# Altium schematic sheet TSC-Lab.SchDoc
size A4
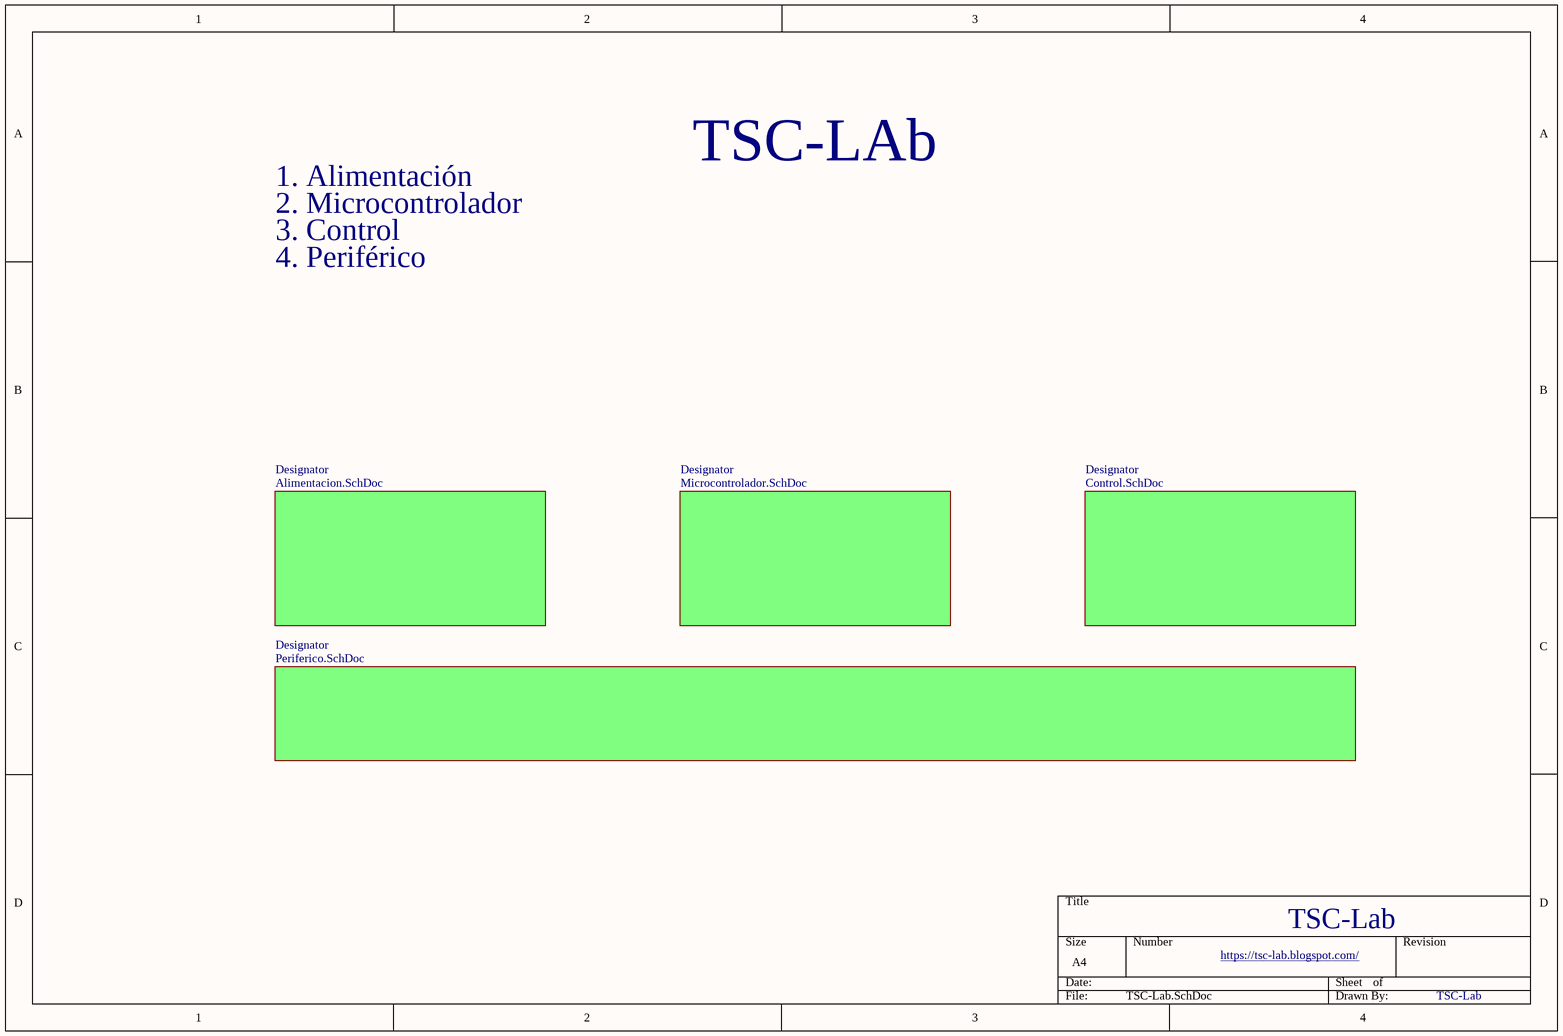
[diagram p0: TSC-Lab.SchDoc]

## Sub-sheets
Designator = Alimentacion.SchDoc: no entries
Designator = Microcontrolador.SchDoc: no entries
Designator = Control.SchDoc: no entries
Designator = Periferico.SchDoc: no entries

## Notes on the sheet
- TSC-LAb
- 1. Alimentación
- 2. Microcontrolador
- 3. Control
- 4. Periférico
- https://tsc-lab.blogspot.com/
- TSC-Lab